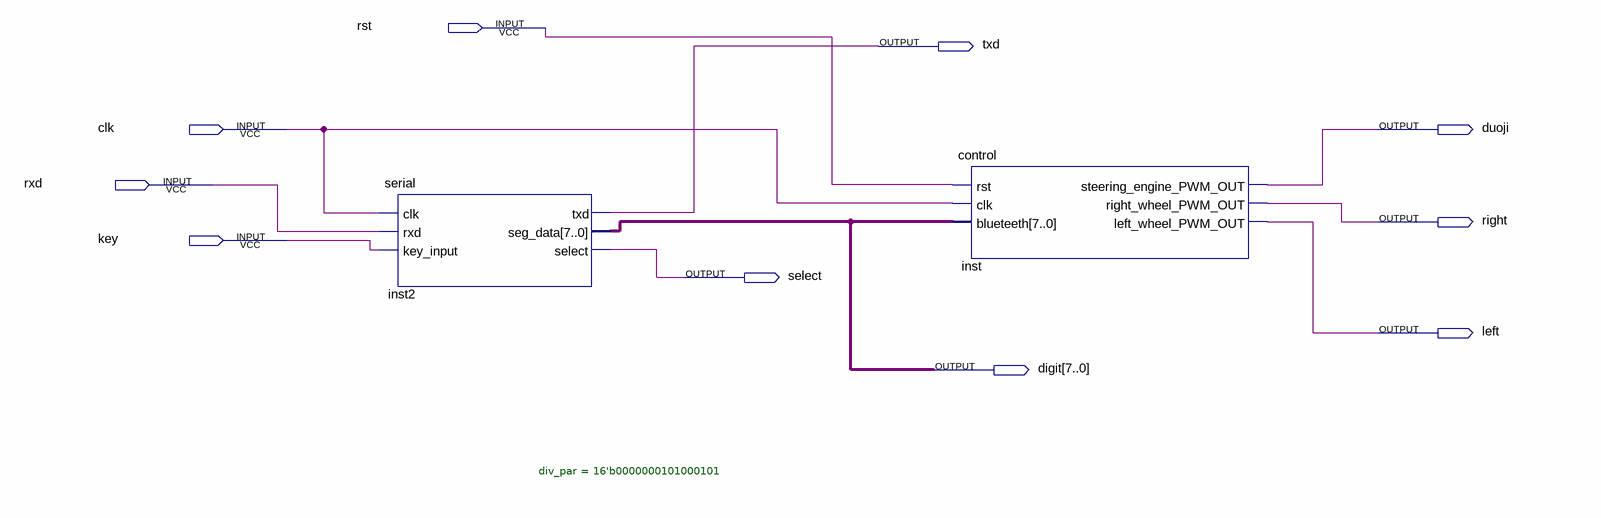
[diagram p0: schematic sheet]
// Quartus schematic bluetooth.bdf as structural Verilog: 2 symbols, 10 pins
module bluetooth (
  input  rst,
  input  clk,
  input  rxd,
  input  key,
  output txd,
  output duoji,
  output right,
  output select,
  output left,
  output [7:0] digit
);

  serial #(.div_par(16'b0000000101000101)) inst2 (
    .clk(clk), .rxd(rxd), .key_input(key), .txd(txd), .seg_data(digit), .select(select));
  control inst (
    .rst(rst), .clk(clk), .blueteeth(digit), .steering_engine_PWM_OUT(duoji), .right_wheel_PWM_OUT(right),
    .left_wheel_PWM_OUT(left));
endmodule
